# EAGLE design main (EAGLE 9.6.2)
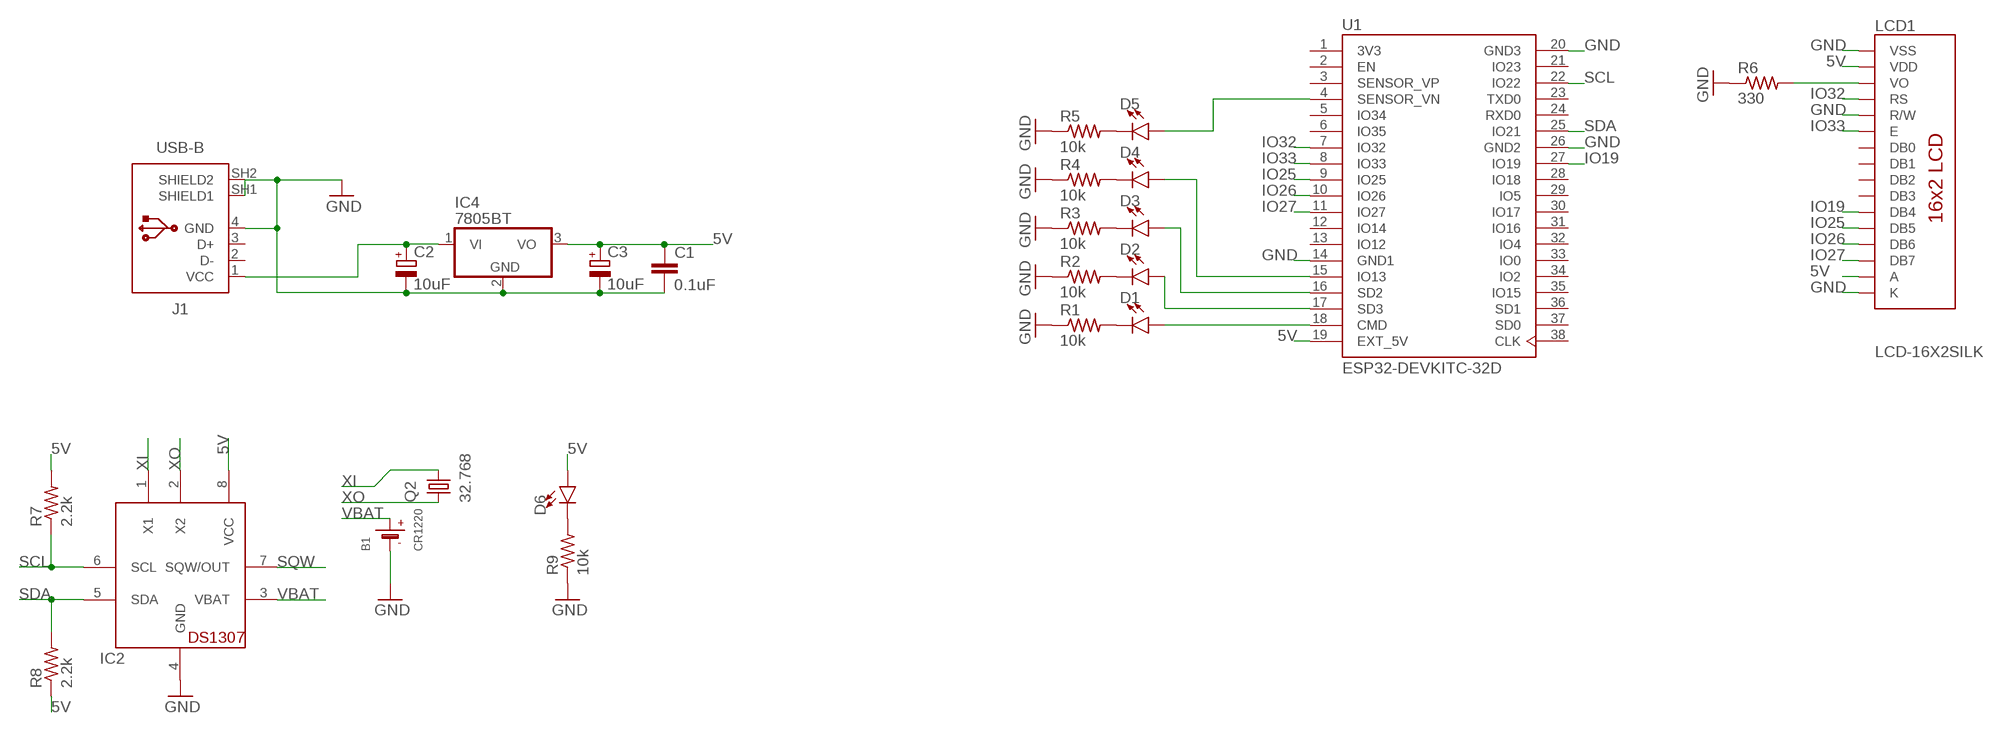
[diagram p0: schematic, sheet 1]

## Parts
B1  CR1220  BATTERYCR1220_SMT  [CR1220]
C1  0.1uF  C-EU050-024X044  [C050-024X044]
C2  10uF  CPOL-EUE2-5  [E2-5]
C3  10uF  CPOL-EUE2-5  [E2-5]
D1  LED5MM  [LED_5MM]
D2  LED5MM  [LED_5MM]
D3  LED5MM  [LED_5MM]
D4  LED5MM  [LED_5MM]
D5  LED5MM  [LED_5MM]
D6  LED5MM  [LED_5MM]
IC2  DS1307  [DIL08]
IC4  7805BT  7805TV  [TO220V]
J1  USB-B  61729-1011  [61729-1011BLF]
LCD1  LCD-16X2SILK  [LCD-16X2]
Q2  32.768  CRYSTALTC26V  [TC26V]
R1  10k  R-US_0207/7  [0207/7]
R2  10k  R-US_0207/7  [0207/7]
R3  10k  R-US_0207/7  [0207/7]
R4  10k  R-US_0207/7  [0207/7]
R5  10k  R-US_0207/7  [0207/7]
R6  330  R-US_0207/7  [0207/7]
R7  2.2k  R-US_0207/7  [0207/7]
R8  2.2k  R-US_0207/7  [0207/7]
R9  10k  R-US_0207/7  [0207/7]
U1  ESP32-DEVKITC-32D  [MODULE_ESP32-DEVKITC-32D]

## Nets
5V: C1.1 C3.+ D6.A IC2.8(VCC) IC4.3(VO) LCD1.2(VDD) LCD1.15(A) R7.2 R8.1 U1.19(EXT_5V)
GND: B1.- C1.2 C2.- C3.- IC2.4(GND) IC4.2(GND) J1.4(GND) J1.SH1(SHIELD1) J1.SH2(SHIELD2) LCD1.1(VSS) LCD1.5(R/W) LCD1.16(K) R1.1 R2.1 R3.1 R4.1 R5.1 R6.1 R9.1 U1.14(GND1) U1.20(GND3) U1.26(GND2)
IO19: LCD1.11(DB4) U1.27(IO19)
IO25: LCD1.12(DB5) U1.9(IO25)
IO26: LCD1.13(DB6) U1.10(IO26)
IO27: LCD1.14(DB7) U1.11(IO27)
IO32: LCD1.4(RS) U1.7(IO32)
IO33: LCD1.6(E) U1.8(IO33)
N$1: D6.K(C) R9.2
N$2: D1.A U1.18(CMD)
N$3: D2.A U1.17(SD3)
N$4: D3.A U1.16(SD2)
N$5: D4.A U1.15(IO13)
N$6: D5.A U1.4(SENSOR_VN)
N$7: D1.K(C) R1.2
N$8: LCD1.3(VO) R6.2
N$9: D2.K(C) R2.2
N$10: D3.K(C) R3.2
N$11: D4.K(C) R4.2
N$12: D5.K(C) R5.2
N$14: C2.+ IC4.1(VI) J1.1(VCC)
SCL: IC2.6(SCL) R7.1 U1.22(IO22)
SDA: IC2.5(SDA) R8.2 U1.25(IO21)
SQW: IC2.7(SQW/OUT)
VBAT: B1.+$1(+) IC2.3(VBAT)
XI: IC2.1(X1) Q2.2
XO: IC2.2(X2) Q2.1
Unconnected: J1.2(D-) J1.3(D+) LCD1.7(DB0) LCD1.8(DB1) LCD1.9(DB2) LCD1.10(DB3) U1.2(EN) U1.3(SENSOR_VP) U1.5(IO34) U1.6(IO35) U1.12(IO14) U1.13(IO12) U1.21(IO23) U1.23(TXD0) U1.24(RXD0) U1.28(IO18) U1.29(IO5) U1.30(IO17) U1.31(IO16) U1.32(IO4) U1.33(IO0) U1.34(IO2) U1.35(IO15) U1.36(SD1) U1.37(SD0) U1.38(CLK)

## Power pins joined to a net without a drawn wire
3V3: U1.1(3V3)

## Library data of the parts
B1 = microbuilder:BATTERY: CR1220 SMT - Digikey: 3001K-ND CD2032 BAT-HLD-001 - Digikey: BAT-HLD-001-ND
C1 = rcl:C-EU: CAPACITOR, European symbol; SPICEPREFIX: C
C2 C3 = rcl:CPOL-EU: POLARIZED CAPACITOR, European symbol; SPICEPREFIX: C
D1-D6 = SparkFun-LED:LED: LED (Generic) Standard schematic elements and footprints for 5mm, 3mm, 1206, and 0603 sized LEDs. Generic LEDs with no color specified.
IC2 = adafruit:DS1307: DS1307 Real time clock (RTC) with battery backup ability. Talk to it via i2c
IC4 = linear:78*: Positive VOLTAGE REGULATOR Source: http://cache.national.com/ds/LM/LM78L05.pdf http://www.fairchildsemi.com/ds/LM/LM7805.pdf
J1 = Connector_USB:61729-1011: USB(2.0) Type-B, RCPT, 4POS, THT-R/A Datasheet <https://www.amphenol-icc.com/media/wysiwyg/files/drawing/61729.pdf>; CATEGORY: Connector; CONTACTS: 4; CURRENT_RATING: 1A; DESCRIPTION: CONN RCPT USB2.0 TYPEB 4POS R/A; GENDER: Receptacle; MANUFACTURER: Amphenol ICC (FCI); MOUNT_TYPE: R/A; MPN: 61729-1011BLF; OPERATING_TEMP: -55°C to 85°C; PART_STATUS: Active; ROHS_COMPLIANT: RoHS Compliant; SERIES: 61729; SUB-CATEGORY: USB; TYPE: USB-B
LCD1 = SparkFun-Displays:LCD-16X2: Standard text-only 16x2 parallel input LCD Basic 16 character by 2 line display. Typically utilizes the extremely common HD44780 parallel interface chipset SparkFun Products: Basic 16x2 Green <https://www.sparkfun.com/products/255> Basic 8x2 Green <https://www.sparkfun.com/products/11122>; SF_ID: LCD-00255
Q2 = adafruit:CRYSTAL: CRYSTAL; OC_FARNELL: unknown; OC_NEWARK: unknown
R1-R9 = rcl:R-US_: RESISTOR, American symbol; SPICEPREFIX: R
U1 = ESP32-DEVKITC-32D:ESP32-DEVKITC-32D: Eval Board For Esp-Wroom-32 Check availability <https://pricing.snapeda.com/parts/ESP32-DEVKITC-32D/Espressif%20Systems/view-part?ref=eda>; AVAILABILITY: In Stock; DESCRIPTION: WiFi Development Tools (802.11) ESP32 General Development Kit, ESP32-WROOM-32D on the board; MF: Espressif Systems; MP: ESP32-DEVKITC-32D; PACKAGE: None; PRICE: None; PURCHASE-URL: https://pricing.snapeda.com/search/part/ESP32-DEVKITC-32D/?ref=eda

## Board
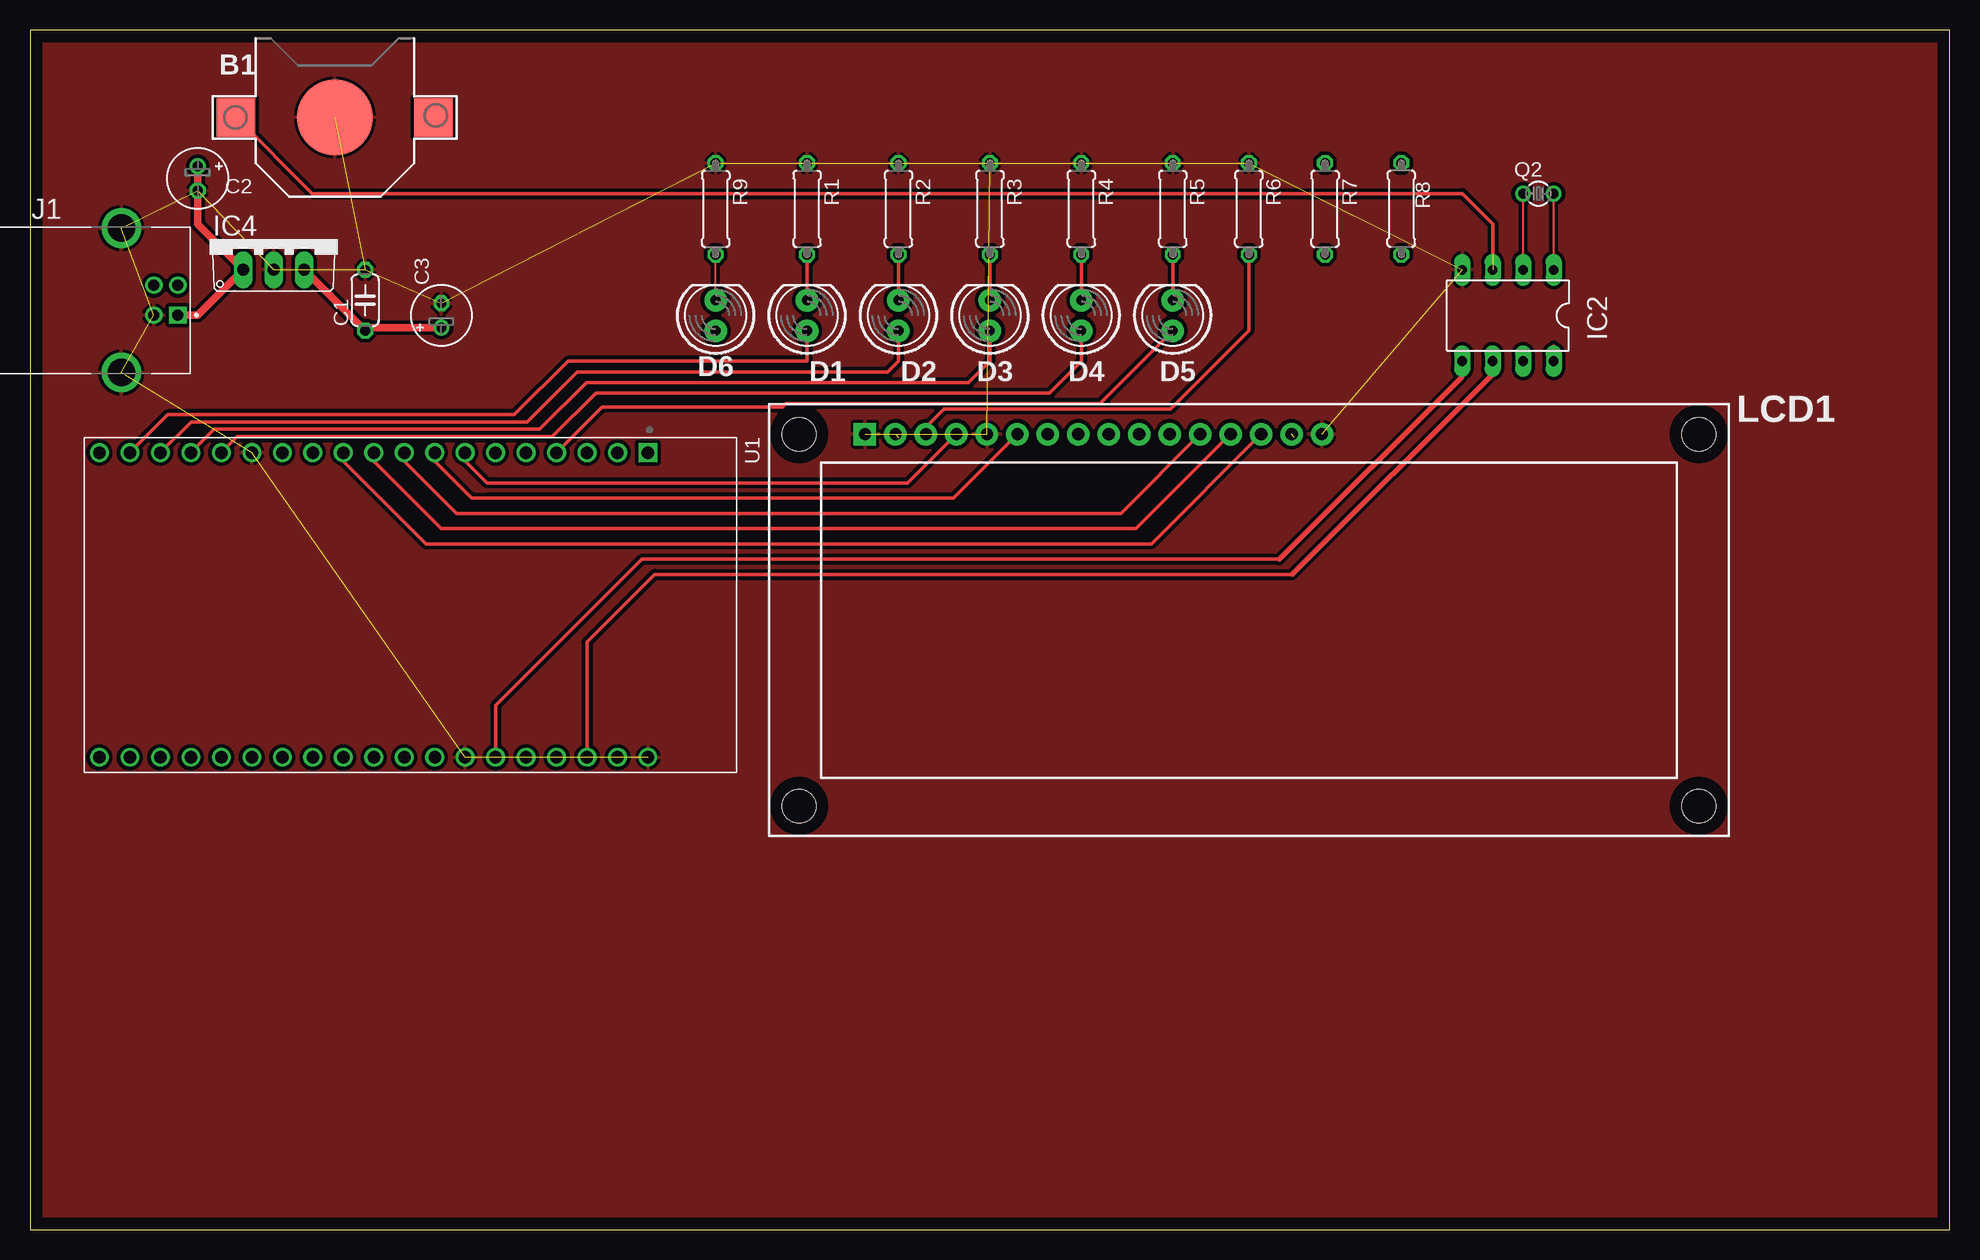
[diagram p1: board, top side]
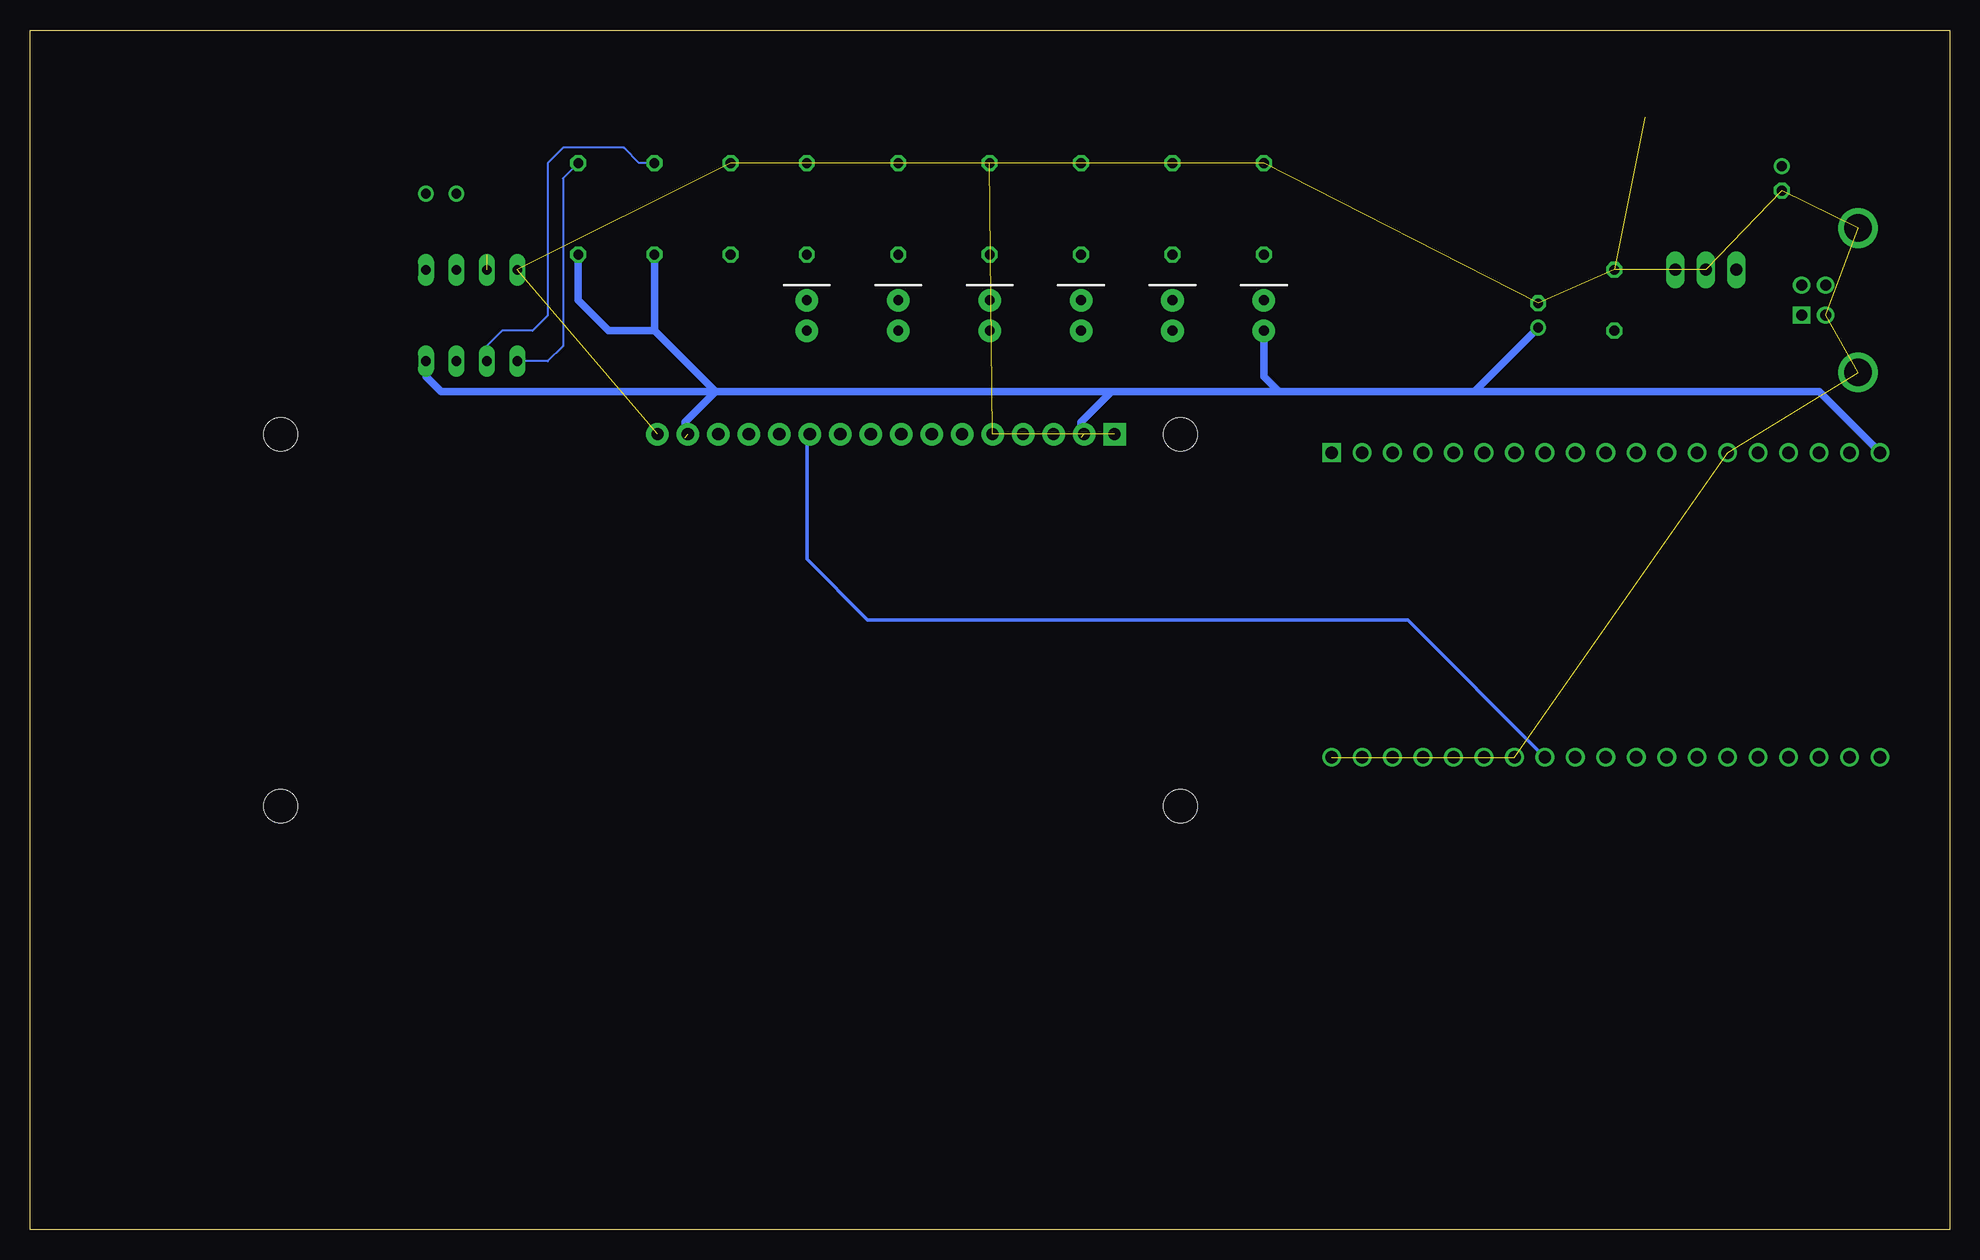
[diagram p2: board, bottom side, seen from below]

Size 160 x 100 mm. Coordinates in mm from the lower left corner, seen from the top.
Outline: 0,0 160,0 160,100 0,100 0,0
Copper layers (1*16): Top 0.035mm / dielectric 1.5mm / Bottom 0.035mm
Design rules "default": minimum track width 6mil, minimum drill 0.35mm, track to track 6mil, track to pad 6mil, pad to pad 6mil, via to via 6mil, smd to smd 6mil, copper to edge 40mil, drill to drill 6mil, minimum pad ring 10mil, minimum via ring 8mil, stop-mask expansion 4mil, vias tented up to drill 0mil, thermal gap 10mil

### Footprints (pad centres in the part's own frame; a part is rotated, then mirrored left to right if it is on the bottom)
CR1220 = smd 3.2 x 3.2: +$1 -8.225,0; +$2 8.225,0 | smd 6.35 x 6.35: - 0,0
C050-024X044 = drill 0.813 octagon: 1 -2.54,0; 2 2.54,0
E2-5 = drill 0.813 pad 1.27: + -1.016,0 | drill 0.813 pad 1.27 octagon: - 1.016,0
LED_5MM = drill 0.813 pad 1.88: A -1.27,0; K 1.27,0
DIL08 = drill 0.813 long: 1 -3.81,-3.81; 2 -1.27,-3.81; 3 1.27,-3.81; 4 3.81,-3.81; 5 3.81,3.81; 6 1.27,3.81; 7 -1.27,3.81; 8 -3.81,3.81
TO220V = drill 1.016 long: 1 -2.54,-2.54; 2 0,-2.54; 3 2.54,-2.54
61729-1011BLF = drill 0.92 square: 1 1.25,4.71 | drill 0.92: 2 -1.25,4.71; 3 -1.25,2.71; 4 1.25,2.71 | drill 2.3: SH1 -6.02,0; SH2 6.02,0
LCD-16X2 = drill 1.016 pad 1.88 square: 1 -32,15.5 | drill 1.016 pad 1.88: 2 -29.46,15.5; 3 -26.92,15.5; 4 -24.38,15.5; 5 -21.84,15.5; 6 -19.3,15.5; 7 -16.76,15.5; 8 -14.22,15.5; 9 -11.68,15.5; 10 -9.14,15.5; 11 -6.6,15.5; 12 -4.06,15.5; 13 -1.52,15.5; 14 1.02,15.5; 15 3.56,15.5; 16 6.1,15.5 | hole 2.8: -37.5,15.5; -37.5,-15.5; 37.5,15.5; 37.5,-15.5
TC26V = drill 0.813: 1 -1.27,0; 2 1.27,0
0207/7 = drill 0.813 octagon: 1 -3.81,0; 2 3.81,0
MODULE_ESP32-DEVKITC-32D = drill 1.04 square: 1 -12.7,19.76 | drill 1.04: 2 -12.7,17.22; 3 -12.7,14.68; 4 -12.7,12.14; 5 -12.7,9.6; 6 -12.7,7.06; 7 -12.7,4.52; 8 -12.7,1.98; 9 -12.7,-0.56; 10 -12.7,-3.1; 11 -12.7,-5.64; 12 -12.7,-8.18; 13 -12.7,-10.72; 14 -12.7,-13.26; 15 -12.7,-15.8; 16 -12.7,-18.34; 17 -12.7,-20.88; 18 -12.7,-23.42; 19 -12.7,-25.96; 20 12.7,19.76; 21 12.7,17.22; 22 12.7,14.68; 23 12.7,12.14; 24 12.7,9.6; 25 12.7,7.06; 26 12.7,4.52; 27 12.7,1.98; 28 12.7,-0.56; 29 12.7,-3.1; 30 12.7,-5.64; 31 12.7,-8.18; 32 12.7,-10.72; 33 12.7,-13.26; 34 12.7,-15.8; 35 12.7,-18.34; 36 12.7,-20.88; 37 12.7,-23.42; 38 12.7,-25.96

### Placement (x,y rotation side)
B1  25.4,92.71 0 top
C1  27.94,77.47 90 top
C2  13.97,87.63 270 top
C3  34.29,76.2 90 top
D1  64.77,76.2 90 top
D2  72.39,76.2 90 top
D3  80.01,76.2 90 top
D4  87.63,76.2 90 top
D5  95.25,76.2 90 top
D6  57.15,76.2 90 top
IC2  123.19,76.2 180 top
IC4  20.32,82.55 0 top
J1  7.62,77.47 270 top
LCD1  101.6,50.8 0 top
Q2  125.73,86.36 0 top
R1  64.77,85.09 270 top
R2  72.39,85.09 270 top
R3  80.01,85.09 270 top
R4  87.63,85.09 270 top
R5  95.25,85.09 270 top
R6  101.6,85.09 270 top
R7  107.95,85.09 270 top
R8  114.3,85.09 90 top
R9  57.15,85.09 270 top
U1  31.75,52.07 270 top

### Tracks (layer width: path | path; a pad name or v marks a point on that pad's centre or on a via)
5V  (2 unrouted)
  Top 0.305: 127,73.66 IC2.8
  Top 0.61: IC4.3 C1.1 28.19,75.18 C3.+
  Bottom 0.61: C3.+ 39.62,69.85 | 39.62,69.85 55.88,69.85 | 55.88,69.85 69.85,69.85 | 69.85,69.85 72.39,67.31 72.39,66.04 | 69.85,69.85 102.87,69.85 | 102.87,69.85 105.41,67.31 105.41,66.04 | 102.87,69.85 107.95,74.93 | R7.2 107.95,74.93 | 107.95,74.93 111.76,74.93 114.3,77.47 R8.1 | 102.87,69.85 125.73,69.85 127,71.12 IC2.8 | U1.19 10.87,69.85 39.62,69.85 | D6.A 57.15,71.12 55.88,69.85
GND  (21 unrouted)
  pour Top (isolate 0.305): 0,100.33 160.02,100.33 160.02,74.93 160.02,0 0,0
IO19
  Bottom 0.305: U1.27 45.16,50.8 90.17,50.8 95.25,55.88 95.25,66.05 LCD1.11
IO25
  Top 0.305: LCD1.12 90.93,59.69 35.56,59.69 31.19,64.06 U1.9
IO26
  Top 0.305: LCD1.13 92.2,58.42 34.29,58.42 28.65,64.06 U1.10
IO27
  Top 0.305: LCD1.14 93.47,57.15 33.02,57.15 26.11,64.06 U1.11
IO32
  Top 0.305: LCD1.4 73.15,62.23 38.1,62.23 36.27,64.06 U1.7
IO33
  Top 0.305: LCD1.6 76.96,60.96 40.64,60.96 38.1,60.96 36.83,60.96 33.73,64.06 U1.8
N$1
  Top 0.152: D6.K R9.2
N$2
  Top 0.305: D1.A 64.77,72.39 44.85,72.39 40.38,67.92 11.48,67.92 U1.18
N$3
  Top 0.305: D2.A 72.39,72.39 71.48,71.48 45.6,71.48 41.45,67.33 13.43,67.33 U1.17
N$4
  Top 0.305: D3.A 80.01,72.39 78.23,70.61 46.4,70.61 42.5,66.71 15.35,66.71 U1.16
N$5
  Top 0.305: D4.A 87.63,72.39 84.98,69.74 47.19,69.74 43.54,66.09 17.27,66.09 U1.15
N$6
  Top 0.305: D5.A 89.19,68.87 63.04,68.87 62.75,68.58 47.7,68.58 U1.4
N$7
  Top 0.305: R1.2 D1.K
N$8
  Top 0.305: R6.2 101.6,74.93 95.08,68.41 76.2,68.41 74.68,66.89 LCD1.3
N$9
  Top 0.305: R2.2 D2.K
N$10
  Top 0.305: R3.2 D3.K
N$11
  Top 0.305: R4.2 D4.K
N$12
  Top 0.305: R5.2 D5.K
N$14
  Top 0.61: J1.1 13.99,76.22 IC4.1 13.97,83.82 C2.+
SCL
  Top 0.305: 105.19,54.61 52.07,54.61 46.43,48.97 U1.22
  Top 0.406: 105.19,54.61 105.2,54.61 121.92,71.33 IC2.6
  Bottom 0.152: R7.1 109.22,88.9 110.49,90.17 115.57,90.17 116.84,88.9 116.84,76.2 118.11,74.93 120.65,74.93 121.92,73.66 IC2.6
SDA
  Top 0.305: 104.14,55.88 51.02,55.88 38.81,43.67 U1.25
  Top 0.406: IC2.5 119.38,71.12 104.14,55.88
  Bottom 0.152: R8.2 115.57,87.63 115.57,73.66 116.84,72.39 IC2.5
VBAT  (1 unrouted)
  Top 0.305: B1.+$1 23.52,86.36 119.38,86.36 121.92,83.82 121.92,81.28
XI
  Top 0.152: IC2.1 Q2.2
XO
  Top 0.152: IC2.2 Q2.1